# EAGLE design p128fet (EAGLE 9.6.2)
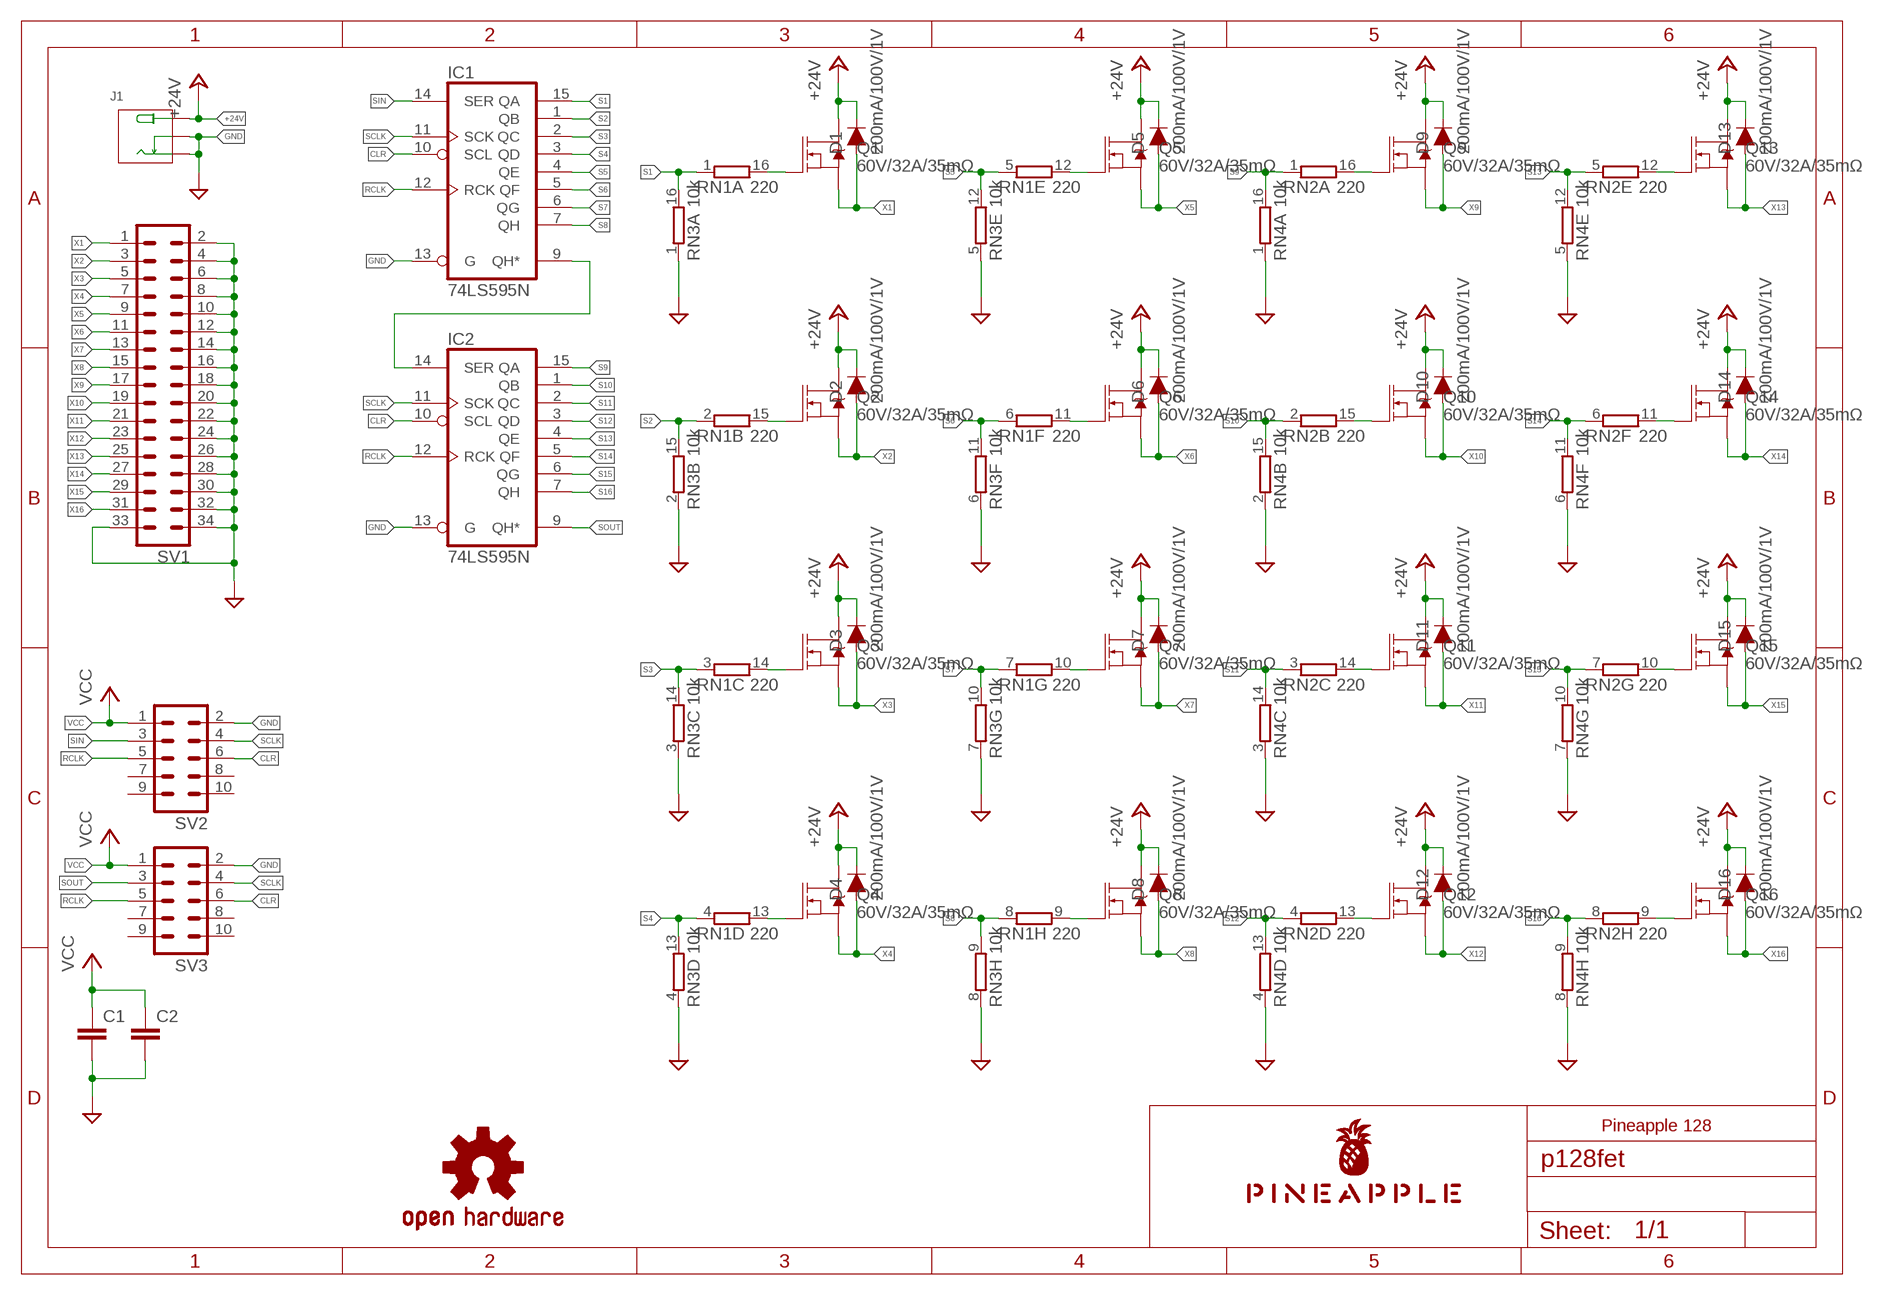
[diagram p0: schematic, sheet 1]

## Parts
C1  C-EU025-024X044  [C025-024X044]
C2  C-EU025-024X044  [C025-024X044]
D1  200mA/100V/1V  DIODE-1N4148  [DIODE-1N4148]
D2  200mA/100V/1V  DIODE-1N4148  [DIODE-1N4148]
D3  200mA/100V/1V  DIODE-1N4148  [DIODE-1N4148]
D4  200mA/100V/1V  DIODE-1N4148  [DIODE-1N4148]
D5  200mA/100V/1V  DIODE-1N4148  [DIODE-1N4148]
D6  200mA/100V/1V  DIODE-1N4148  [DIODE-1N4148]
D7  200mA/100V/1V  DIODE-1N4148  [DIODE-1N4148]
D8  200mA/100V/1V  DIODE-1N4148  [DIODE-1N4148]
D9  200mA/100V/1V  DIODE-1N4148  [DIODE-1N4148]
D10  200mA/100V/1V  DIODE-1N4148  [DIODE-1N4148]
D11  200mA/100V/1V  DIODE-1N4148  [DIODE-1N4148]
D12  200mA/100V/1V  DIODE-1N4148  [DIODE-1N4148]
D13  200mA/100V/1V  DIODE-1N4148  [DIODE-1N4148]
D14  200mA/100V/1V  DIODE-1N4148  [DIODE-1N4148]
D15  200mA/100V/1V  DIODE-1N4148  [DIODE-1N4148]
D16  200mA/100V/1V  DIODE-1N4148  [DIODE-1N4148]
IC1  74LS595N  [DIL16]
IC2  74LS595N  [DIL16]
J1  JACK-DC-005'DC-005'  [3P-L14.2*W11.0*H9.0MM]
LOGO1  OSHW-LOGOS-COPPER  [OSHW-LOGO-S_COPPER]
Q1  60V/32A/35mΩ  MOSFET-NCH-FQP30N06L  [TO220V]
Q2  60V/32A/35mΩ  MOSFET-NCH-FQP30N06L  [TO220V]
Q3  60V/32A/35mΩ  MOSFET-NCH-FQP30N06L  [TO220V]
Q4  60V/32A/35mΩ  MOSFET-NCH-FQP30N06L  [TO220V]
Q5  60V/32A/35mΩ  MOSFET-NCH-FQP30N06L  [TO220V]
Q6  60V/32A/35mΩ  MOSFET-NCH-FQP30N06L  [TO220V]
Q7  60V/32A/35mΩ  MOSFET-NCH-FQP30N06L  [TO220V]
Q8  60V/32A/35mΩ  MOSFET-NCH-FQP30N06L  [TO220V]
Q9  60V/32A/35mΩ  MOSFET-NCH-FQP30N06L  [TO220V]
Q10  60V/32A/35mΩ  MOSFET-NCH-FQP30N06L  [TO220V]
Q11  60V/32A/35mΩ  MOSFET-NCH-FQP30N06L  [TO220V]
Q12  60V/32A/35mΩ  MOSFET-NCH-FQP30N06L  [TO220V]
Q13  60V/32A/35mΩ  MOSFET-NCH-FQP30N06L  [TO220V]
Q14  60V/32A/35mΩ  MOSFET-NCH-FQP30N06L  [TO220V]
Q15  60V/32A/35mΩ  MOSFET-NCH-FQP30N06L  [TO220V]
Q16  60V/32A/35mΩ  MOSFET-NCH-FQP30N06L  [TO220V]
RN1  220  8R-N  [DIL16]
RN2  220  8R-N  [DIL16]
RN3  10k  8R-N  [DIL16]
RN4  10k  8R-N  [DIL16]
SV1  ML34L  [ML34L]
SV2  ML10L  [ML10L]
SV3  ML10L  [ML10L]
U$1  PINEAPPLE450_SILK  [PINEAPPLE450_SILK]

## Nets
+24V [power]: D1.C D2.C D3.C D4.C D5.C D6.C D7.C D8.C D9.C D10.C D11.C D12.C D13.C D14.C D15.C D16.C J1.+ Q1.2(D) Q2.2(D) Q3.2(D) Q4.2(D) Q5.2(D) Q6.2(D) Q7.2(D) Q8.2(D) Q9.2(D) Q10.2(D) Q11.2(D) Q12.2(D) Q13.2(D) Q14.2(D) Q15.2(D) Q16.2(D)
CLR: IC1.10(SCL) IC2.10(SCL) SV2.6 SV3.6
GND [gnd]: C1.2 C2.2 IC1.13(G) IC2.13(G) J1.-1(-) J1.-2(CDN) RN3.1 RN3.2 RN3.3 RN3.4 RN3.5 RN3.6 RN3.7 RN3.8 RN4.1 RN4.2 RN4.3 RN4.4 RN4.5 RN4.6 RN4.7 RN4.8 SV1.2 SV1.4 SV1.6 SV1.8 SV1.10 SV1.12 SV1.14 SV1.16 SV1.18 SV1.20 SV1.22 SV1.24 SV1.26 SV1.28 SV1.30 SV1.32 SV1.33 SV1.34 SV2.2 SV3.2
N$1: Q1.1(G) RN1.16
N$2: Q2.1(G) RN1.15
N$3: Q3.1(G) RN1.14
N$4: Q4.1(G) RN1.13
N$5: Q5.1(G) RN1.12
N$6: Q6.1(G) RN1.11
N$7: Q7.1(G) RN1.10
N$8: Q8.1(G) RN1.9
N$9: IC1.9(QH*) IC2.14(SER)
N$10: Q9.1(G) RN2.16
N$11: Q10.1(G) RN2.15
N$12: Q14.1(G) RN2.11
N$13: Q11.1(G) RN2.14
N$14: Q15.1(G) RN2.10
N$15: Q12.1(G) RN2.13
N$16: Q16.1(G) RN2.9
N$25: Q13.1(G) RN2.12
RCLK: IC1.12(RCK) IC2.12(RCK) SV2.5 SV3.5
S1: IC1.15(QA) RN1.1 RN3.16
S2: IC1.1(QB) RN1.2 RN3.15
S3: IC1.2(QC) RN1.3 RN3.14
S4: IC1.3(QD) RN1.4 RN3.13
S5: IC1.4(QE) RN1.5 RN3.12
S6: IC1.5(QF) RN1.6 RN3.11
S7: IC1.6(QG) RN1.7 RN3.10
S8: IC1.7(QH) RN1.8 RN3.9
S9: IC2.15(QA) RN2.1 RN4.16
S10: IC2.1(QB) RN2.2 RN4.15
S11: IC2.2(QC) RN2.3 RN4.14
S12: IC2.3(QD) RN2.4 RN4.13
S13: IC2.4(QE) RN2.5 RN4.12
S14: IC2.5(QF) RN2.6 RN4.11
S15: IC2.6(QG) RN2.7 RN4.10
S16: IC2.7(QH) RN2.8 RN4.9
SCLK: IC1.11(SCK) IC2.11(SCK) SV2.4 SV3.4
SIN: IC1.14(SER) SV2.3
SOUT: IC2.9(QH*) SV3.3
VCC: C1.1 C2.1 SV2.1 SV3.1
X1 [power]: D1.A Q1.3(S) SV1.1
X2 [power]: D2.A Q2.3(S) SV1.3
X3 [power]: D3.A Q3.3(S) SV1.5
X4 [power]: D4.A Q4.3(S) SV1.7
X5 [power]: D5.A Q5.3(S) SV1.9
X6 [power]: D6.A Q6.3(S) SV1.11
X7 [power]: D7.A Q7.3(S) SV1.13
X8 [power]: D8.A Q8.3(S) SV1.15
X9 [power]: D9.A Q9.3(S) SV1.17
X10 [power]: D10.A Q10.3(S) SV1.19
X11 [power]: D11.A Q11.3(S) SV1.21
X12 [power]: D12.A Q12.3(S) SV1.23
X13 [power]: D13.A Q13.3(S) SV1.25
X14 [power]: D14.A Q14.3(S) SV1.27
X15 [power]: D15.A Q15.3(S) SV1.29
X16 [power]: D16.A Q16.3(S) SV1.31
Unconnected: SV2.7 SV2.8 SV2.9 SV2.10 SV3.7 SV3.8 SV3.9 SV3.10

## Notes on the sheet
- Pineapple 128

## Power pins joined to a net without a drawn wire
GND: IC1.8(GND) IC2.8(GND)
VCC: IC1.16(VCC) IC2.16(VCC)

## Library data of the parts
C1 C2 = resistor:C-EU: CAPACITOR, European symbol
D1-D16 = SparkFun-DiscreteSemi:DIODE: Diode These are standard reverse protection diodes and small signal diodes. SparkFun Products: SparkFun SparkPunk Sound Kit <https://www.sparkfun.com/products/11177> SparkFun ESP8266 Thing <https://www.sparkfun.com/products/13231>; PROD_ID: DIO-08378
IC1 IC2 = 74xx-us:74*595: 8-bit SHIFT REGISTER, output latch
J1 = Seeed-Connector:JACK-DC-005: 320120003
LOGO1 = SparkFun-Aesthetics:OSHW-LOGO: Open-Source Hardware (OSHW) Logo This logo indicates the piece of hardware it is found on incorporates a OSHW license and/or adheres to the definition of open source hardware found here: http://freedomdefined.org/OSHW
Q1-Q16 = SparkFun-DiscreteSemi:MOSFET-NCH: N-channel MOSFETs Voltage controlled devices that allow control of high current outputs. SparkFun Products: SparkFun OpenScale <https://www.sparkfun.com/products/13261> SparkFun Digital Sandbox <https://www.sparkfun.com/products/12651> SparkFun Monster Moto Shield <https://www.sparkfun.com/products/10182> SparkFun MOSFET Power Controller <https://www.sparkfun.com/products/11214>; PROD_ID: TRANS-10060
RN1-RN4 = resistor-dil:8R-N: DIL RESISTOR; OC_FARNELL: unknown; OC_NEWARK: unknown
SV1 = con-ml:ML34L: HARTING; OC_FARNELL: unknown; OC_NEWARK: unknown
SV2 SV3 = con-ml:ML10L: HARTING; OC_FARNELL: unknown; OC_NEWARK: unknown
U$1 = pineapple:PINEAPPLE450_SILK

## Net classes
0 default: width 0.152 mm, drill 0.152 mm, clearance 0.152 mm
1 gnd: width 0.61 mm, drill 0.152 mm, clearance 0.152 mm
2 power: width 0.61 mm, drill 0.152 mm, clearance 0.152 mm
3 analog: width 0.305 mm, drill 0.152 mm, clearance 0.152 mm

## Board
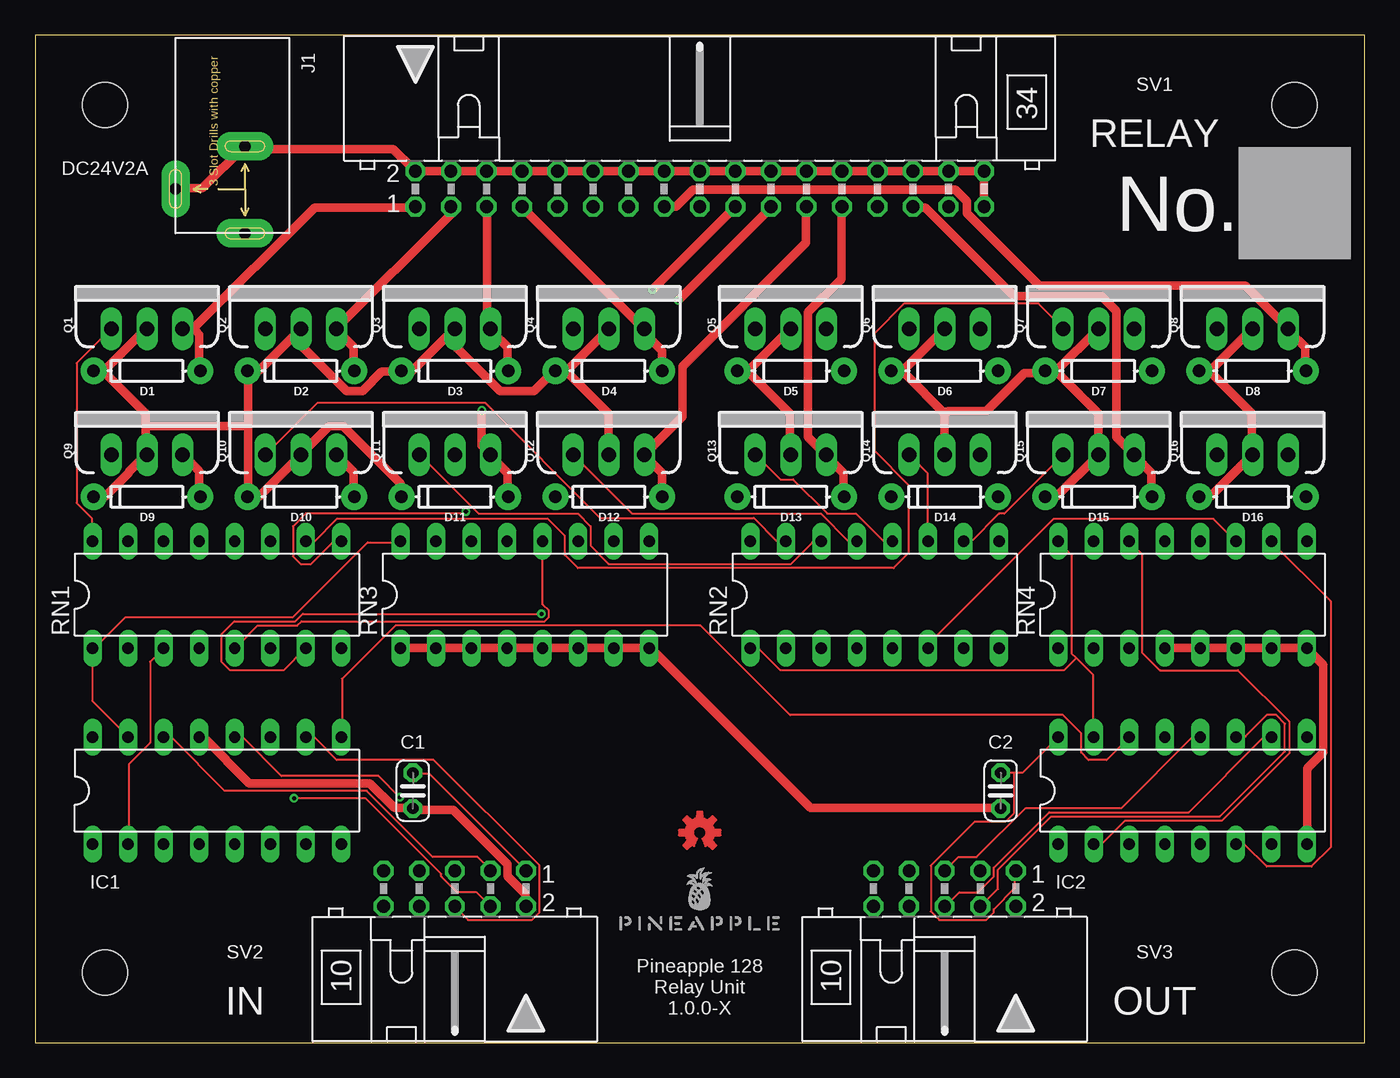
[diagram p1: board, top side]
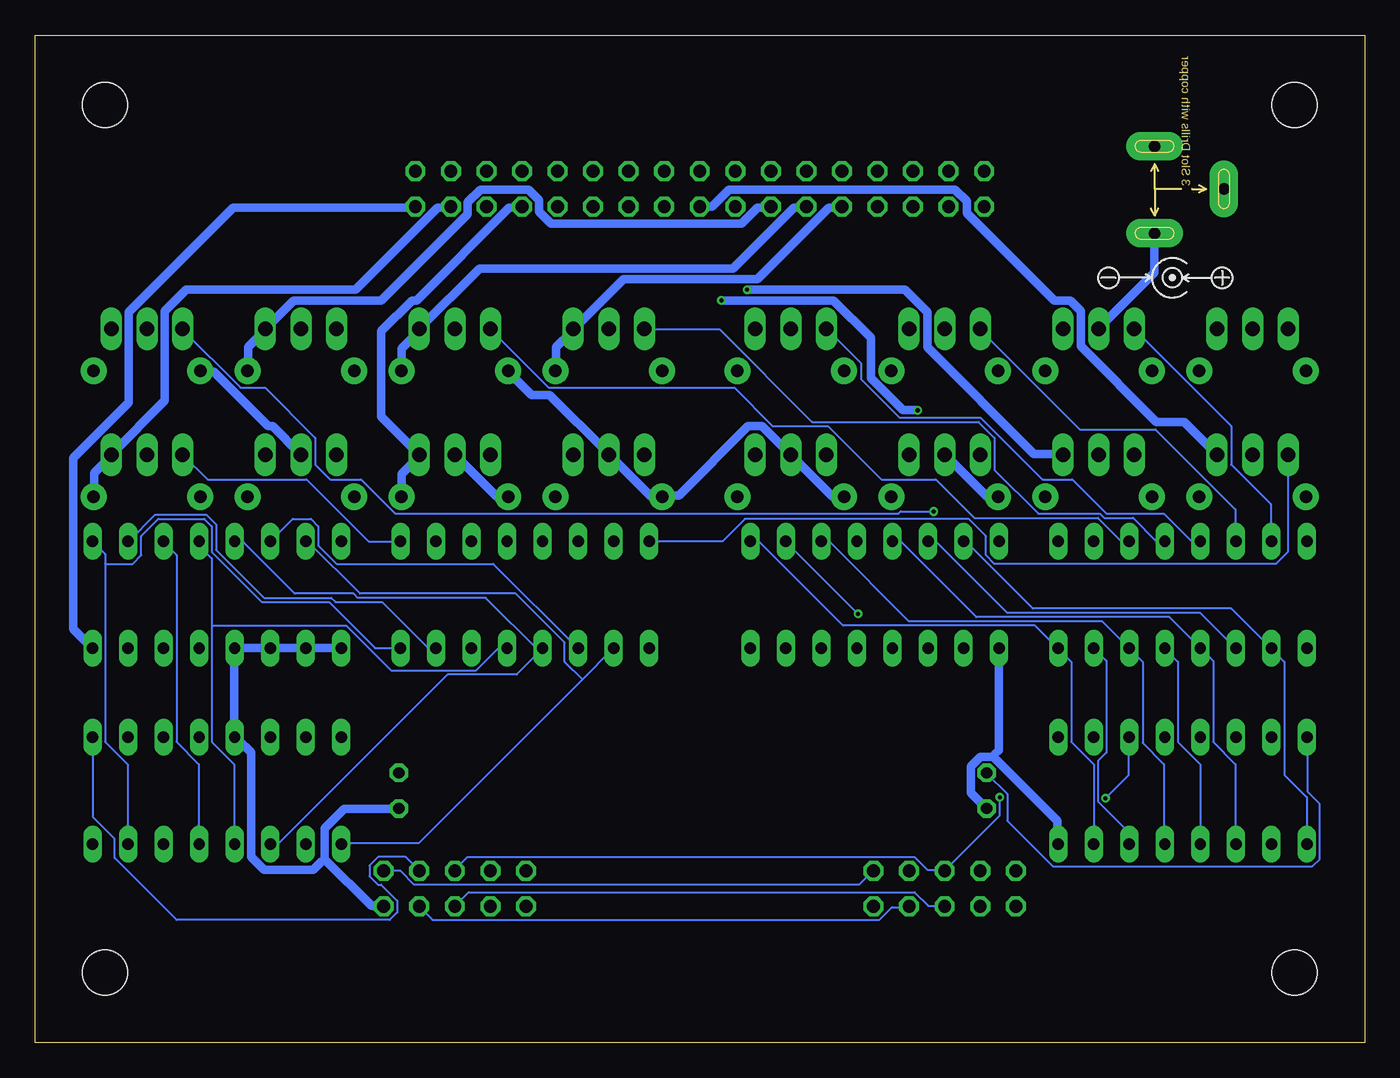
[diagram p2: board, bottom side, seen from below]

Size 95 x 72 mm. Coordinates in mm from the lower left corner, seen from the top.
Outline: 0,0 95,0 95,72 0,72 0,0
Copper layers (1*16): Top 0.035mm / dielectric 1.5mm / Bottom 0.035mm
Design rules "SeeedStudio_2layer_DRU_no_angle_20140221": minimum track width 6mil, minimum drill 12mil, track to track 6mil, track to pad 6mil, pad to pad 6mil, via to via 6mil, smd to smd 0mil, copper to edge 10mil, drill to drill 10mil, minimum pad ring 10mil, minimum via ring 6mil, stop-mask expansion 2mil, vias tented up to drill 100mil, thermal gap 10mil
Holes 3.2 mm at 5,5 90,5 90,67 5,67
tRestrict: area 2.8,64.8 to 7.2,69.2; area 87.8,64.8 to 92.2,69.2; area 2.8,2.8 to 7.2,7.2; area 87.8,2.8 to 92.2,7.2
bRestrict: area 2.8,2.8 to 7.2,7.2; area 87.8,2.8 to 92.2,7.2; area 87.8,64.8 to 92.2,69.2; area 2.8,64.8 to 7.2,69.2

### Footprints (pad centres in the part's own frame; a part is rotated, then mirrored left to right if it is on the bottom)
C025-024X044 = drill 0.813 octagon: 1 -1.27,0; 2 1.27,0
DIODE-1N4148 = drill 0.9 pad 1.88: A -3.81,0; C 3.81,0
DIL16 = drill 0.813 long: 1 -8.89,-3.81; 2 -6.35,-3.81; 3 -3.81,-3.81; 4 -1.27,-3.81; 5 1.27,-3.81; 6 3.81,-3.81; 7 6.35,-3.81; 8 8.89,-3.81; 9 8.89,3.81; 10 6.35,3.81; 11 3.81,3.81; 12 1.27,3.81; 13 -1.27,3.81; 14 -3.81,3.81; 15 -6.35,3.81; 16 -8.89,3.81
3P-L14.2*W11.0*H9.0MM = drill 0.813 pad 2.032 long: + 3.175,0; -1 -3.048,0; -2 0,-4.953
TO220V = drill 1.016 long: 1 -2.54,0; 2 0,0; 3 2.54,0
ML34L = drill 0.914 octagon: 1 -20.32,-1.27; 2 -20.32,1.27; 3 -17.78,-1.27; 4 -17.78,1.27; 5 -15.24,-1.27; 6 -15.24,1.27; 7 -12.7,-1.27; 8 -12.7,1.27; 9 -10.16,-1.27; 10 -10.16,1.27; 11 -7.62,-1.27; 12 -7.62,1.27; 13 -5.08,-1.27; 14 -5.08,1.27; 15 -2.54,-1.27; 16 -2.54,1.27; 17 0,-1.27; 18 0,1.27; 19 2.54,-1.27; 20 2.54,1.27; 21 5.08,-1.27; 22 5.08,1.27; 23 7.62,-1.27; 24 7.62,1.27; 25 10.16,-1.27; 26 10.16,1.27; 27 12.7,-1.27; 28 12.7,1.27; 29 15.24,-1.27; 30 15.24,1.27; 31 17.78,-1.27; 32 17.78,1.27; 33 20.32,-1.27; 34 20.32,1.27
ML10L = drill 0.914 octagon: 1 -5.08,-1.27; 2 -5.08,1.27; 3 -2.54,-1.27; 4 -2.54,1.27; 5 0,-1.27; 6 0,1.27; 7 2.54,-1.27; 8 2.54,1.27; 9 5.08,-1.27; 10 5.08,1.27

### Placement (x,y rotation side)
C1  27,18 270 top
C2  69,18 270 top
D1  8,48 180 top
D2  19,48 180 top
D3  30,48 180 top
D4  41,48 180 top
D5  54,48 180 top
D6  65,48 180 top
D7  76,48 180 top
D8  87,48 180 top
D9  8,39 180 top
D10  19,39 180 top
D11  30,39 180 top
D12  41,39 180 top
D13  54,39 180 top
D14  65,39 180 top
D15  76,39 180 top
D16  87,39 180 top
IC1  13,18 0 top
IC2  82,18 0 top
J1  15,61 270 top
LOGO1  47.5,15 0 top
Q1  8,51 0 top
Q2  19,51 0 top
Q3  30,51 0 top
Q4  41,51 0 top
Q5  54,51 0 top
Q6  65,51 0 top
Q7  76,51 0 top
Q8  87,51 0 top
Q9  8,42 0 top
Q10  19,42 0 top
Q11  30,42 0 top
Q12  41,42 0 top
Q13  54,42 0 top
Q14  65,42 0 top
Q15  76,42 0 top
Q16  87,42 0 top
RN1  13,32 0 top
RN2  60,32 0 top
RN3  35,32 0 top
RN4  82,32 0 top
SV1  47.5,61 0 top
SV2  30,11 180 top
SV3  65,11 180 top
U$1  47.5,8 0 top

### Tracks (layer width: path | path; a pad name or v marks a point on that pad's centre or on a via)
+24V
  Top 0.61: D16.C 83.21,39.01 83.97,39.01 86.94,41.99 Q16.2 86.94,42.29 86.94,44.96 84.12,47.78 D8.C 83.21,48.01 83.97,48.01 86.94,50.98 Q8.2 | D15.C 72.24,39.01 73,39.01 75.97,41.99 Q15.2 75.97,42.29 75.97,44.96 73.15,47.78 73,48.01 | 73,48.01 75.97,50.98 Q7.2 | 73,48.01 72.24,48.01 D7.C 71.93,47.85 70.71,47.85 67.97,45.11 65.23,45.11 65,44.96 | 50.98,48.01 53.95,50.98 Q5.2 | 50.98,48.01 50.22,48.01 D5.C | Q13.2 53.95,42.06 53.95,44.96 51.13,47.78 50.98,48.01 | 62.03,48.01 65,50.98 Q6.2 | 62.03,48.01 61.27,48.01 D6.C | 65,44.96 65,42.06 Q14.2 | 65,44.96 62.18,47.78 62.03,48.01 | 38.02,48.01 41,50.98 Q4.2 | 38.02,48.01 37.26,48.01 D4.C 36.96,47.85 35.66,46.56 33.22,46.56 29.57,50.22 Q3.2 29.95,50.98 26.98,48.01 26.21,48.01 D3.C 25.91,47.93 24.77,47.93 23.39,46.56 22.25,46.56 18.59,50.22 Q2.2 18.97,50.98 16,48.01 15.24,48.01 D2.C 15.24,47.7 15.24,44.04 | Q12.2 41,42.06 41,44.96 38.18,47.78 38.02,48.01 | D9.C 4.19,39.01 5.03,39.01 6.71,40.69 6.71,40.77 7.92,41.99 Q9.2 7.92,42.29 7.92,44.04 | Q1.2 7.92,50.98 4.95,48.01 D1.C 5.11,47.78 7.92,44.96 7.92,44.04 | 15.24,44.04 15.24,39.32 D10.C 15.24,39.01 16,39.01 18.97,41.99 Q10.2 19.2,42.22 21.03,44.04 22.02,44.04 26.14,39.93 26.14,39.01 D11.C | 15.24,44.04 7.92,44.04
  Bottom 0.61: Q14.2 65,41.99 62.03,39.01 61.27,39.01 D14.C | D6.C 61.19,47.93 59.51,46.25 58.22,46.25 54.18,42.22 Q13.2 53.95,41.99 50.98,39.01 50.22,39.01 D13.C 49.91,39.09 49,39.09 44.04,44.04 43.05,44.04 41.22,42.22 Q12.2 41,41.99 38.02,39.01 37.26,39.01 D12.C | D8.C 83.13,47.93 82.22,47.93 78.33,44.04 78.03,44.04 76.05,42.06 Q15.2 | Q11.2 29.95,41.99 26.98,39.01 26.21,39.01 D11.C | J1.+ 15.01,57.76 15.01,55.02 18.97,51.05 Q2.2
CLR
  Top 0.152: IC1.10 19.36,21.79 19.96,21.79 21.57,20.19 28.5,20.19 36.04,12.65 36.04,9.3 35.51,8.76 30.94,8.76 30.02,9.68 SV2.6 | IC2.10 88.32,21.79 87.78,21.79 82.45,16.46 72.47,16.46 68.5,12.5 68.5,11.89 67.36,10.74 66.06,10.74 65.08,9.75 SV3.6
  Bottom 0.152: SV2.6 30.02,9.75 31.17,9.75 32.16,10.74 64.01,10.74 65,9.75 SV3.6
GND
  Top 0.61: J1.-2 10.06,61.04 11.96,61.04 14.94,64.01 J1.-1 15.24,63.86 25.6,63.86 26.98,62.48 SV1.2 27.2,62.26 29.72,62.26 SV1.4 30.02,62.26 32.23,62.26 SV1.6 32.54,62.26 34.75,62.26 SV1.8 35.05,62.26 37.34,62.26 SV1.10 37.64,62.26 39.85,62.26 SV1.12 40.16,62.26 42.37,62.26 SV1.14 42.67,62.26 44.96,62.26 SV1.16 45.26,62.26 47.47,62.26 SV1.18 47.78,62.26 49.99,62.26 SV1.20 50.29,62.26 52.58,62.26 SV1.22 52.88,62.26 55.09,62.26 SV1.24 55.4,62.26 57.61,62.26 SV1.26 57.91,62.26 60.2,62.26 SV1.28 60.5,62.26 62.71,62.26 SV1.30 63.02,62.26 65.23,62.26 SV1.32 65.53,62.26 67.51,62.26 SV1.34 67.82,62.26 SV1.33 | IC2.8 90.91,14.25 90.91,19.58 92.05,20.73 92.05,26.98 90.91,28.12 RN4.8 90.6,28.19 88.39,28.19 RN4.7 88.09,28.19 86.11,28.19 RN4.6 83.52,28.19 RN4.5 83.21,28.19 80.77,28.19 RN4.4 | RN3.1 26.14,28.19 28.57,28.19 RN3.2 28.88,28.19 31.17,28.19 RN3.3 31.47,28.19 33.68,28.19 RN3.4 33.98,28.19 36.2,28.19 RN3.5 36.5,28.19 38.79,28.19 RN3.6 39.09,28.19 41.3,28.19 RN3.7 41.6,28.19 43.81,28.19 RN3.8 44.12,28.04 55.4,16.76 68.96,16.76 C2.2 | IC1.13 11.73,21.79 12.04,21.79 15.32,18.52 23.93,18.52 25.68,16.76 26.98,16.76 C1.2 27.28,16.61 29.87,16.61 33.76,12.72 33.76,11.89 35.05,10.59 35.05,9.75 SV2.2
  Bottom 0.61: 74.3,13.11 74.3,15.32 72.92,16.69 69.04,16.69 C2.2 | 74.3,13.11 70.94,9.75 70.1,9.75 SV3.2 | RN4.1 73.15,28.19 75.59,28.19 RN4.2 75.89,28.19 77.95,28.19 RN4.3 78.26,28.19 80.47,28.19 RN4.4 80.77,28.12 80.77,21.87 IC2.13 80.47,21.64 79.55,20.73 79.55,13.26 78.64,12.34 75.13,12.34 74.52,12.95 74.3,13.11 | 26.52,20.42 21.95,15.85 21.95,14.25 IC1.8 | 26.52,20.42 27.43,20.42 28.12,19.74 28.12,17.83 27.05,16.76 C1.2 | RN3.1 26.14,28.12 26.14,20.88 26.36,20.65 26.52,20.42 | SV1.33 67.89,59.66 80.85,59.66 88.32,52.2 88.32,45.72 92.28,41.76 92.28,29.57 90.91,28.19 RN4.8
N$1
  Top 0.152: RN1.16 4.04,35.81 4.04,37.49 2.97,38.56 2.97,48.54 5.41,50.98 Q1.1
N$2
  Bottom 0.152: RN1.15 6.71,35.81 6.71,38.48 9.53,41.3 9.53,44.04 16.46,50.98 Q2.1
N$3
  Bottom 0.152: RN1.14 9.22,35.81 9.22,38.1 14.94,43.81 20.34,43.81 27.51,50.98 Q3.1
N$4
  Bottom 0.152: RN1.13 12.34,35.81 14.33,37.8 18.44,37.8 20.88,40.23 23.01,40.23 27.43,44.65 33.22,44.65 35.97,47.4 35.97,48.54 38.41,50.98 Q4.1
N$5
  Bottom 0.152: RN1.12 14.33,35.81 14.86,35.81 16.54,37.49 18.59,37.49 18.9,37.8 23.32,37.8 26.44,40.92 26.44,43.2 27.58,44.35 39.47,44.35 46.1,50.98 51.44,50.98 Q5.1
N$6
  Bottom 0.152: RN1.11 16.84,35.81 17.37,35.81 19.05,37.49 27.89,37.49 30.63,40.23 34.52,40.23 38.33,44.04 42.29,44.04 45.03,46.79 58.29,46.79 62.48,50.98 Q6.1
N$7
  Top 0.152: RN1.10 19.96,35.81 21.57,37.41 36.65,37.41 37.87,36.2 37.87,34.82 38.79,33.91 61.34,33.91 62.41,34.98 62.41,39.85 59.97,42.29 59.97,50.67 62.1,52.81 71.7,52.81 73.46,51.05 Q7.1
N$8  (via drill 0.3)
  Top 0.152: v30.79,37.95 30.63,37.8 19.36,37.8 18.44,36.88 18.44,34.75 18.97,34.21 19.74,34.21 21.26,35.74 21.87,35.74 RN1.9
  Bottom 0.152: v30.79,37.95 33.15,37.95 33.3,37.8 69.27,37.8 71.7,40.23 73.91,40.23 74.98,41.3 74.98,43.2 78.56,46.79 80.31,46.79 84.51,50.98 Q8.1
N$9
  Top 0.152: IC1.9 21.95,21.87 21.95,25.98 25.76,29.79 47.55,29.79 53.95,23.39 73.46,23.39 74.75,22.1 74.75,20.73 75.29,20.19 76.58,20.19 78.18,21.79 IC2.14
N$10
  Bottom 0.152: RN2.16 51.05,35.81 45.87,35.81 44.27,37.41 28.27,37.41 27.05,36.2 27.05,34.82 26.44,34.21 6.33,34.21 5.49,35.05 5.49,41.99 Q9.1
N$11
  Top 0.152: RN2.15 53.03,35.81 51.36,37.49 40.39,37.49 32.16,45.72 20.19,45.72 16.54,42.06 Q10.1
N$12
  Top 0.152: RN2.11 63.78,35.81 63.78,40.69 62.48,41.99 Q14.1
N$13
  Top 0.152: RN2.14 56.16,35.74 55.55,35.74 54.03,34.21 41,34.21 39.7,35.51 39.7,36.88 38.79,37.8 31.7,37.8 27.51,41.99 Q11.1
N$14
  Top 0.152: RN2.10 66.37,35.81 66.9,35.81 68.89,37.8 69.27,37.8 73.46,41.99 Q15.1
N$15
  Top 0.152: RN2.13 58.67,35.81 58.14,35.81 56.16,37.8 42.67,37.8 38.48,41.99 Q12.1
N$16
  Bottom 0.152: RN2.9 68.96,35.81 71.17,35.81 75.59,40.23 82.68,40.23 84.43,41.99 Q16.1
N$25
  Top 0.152: RN2.12 60.66,35.81 58.67,37.8 56.62,37.8 54.18,40.23 53.26,40.23 51.51,41.99 Q13.1
RCLK  (via drill 0.3)
  Top 0.152: v26.06,17.53 24.54,19.05 17.6,19.05 14.86,21.79 14.33,21.79 IC1.12 | IC2.12 83.21,21.79 82.68,21.79 77.65,16.76 70.79,16.76 67.28,13.26 65.99,13.26 65.08,12.34 SV3.5
  Bottom 0.152: v26.06,17.53 26.06,16.23 29.95,12.34 SV2.5 30.02,12.34 31.24,12.34 32.16,13.26 64.08,13.26 65,12.34 SV3.5
S1
  Top 0.152: IC1.15 6.63,21.87 4.12,24.38 4.12,28.12 RN1.1 4.19,28.12 6.48,30.4 18.44,30.4 23.77,35.74 26.06,35.74 RN3.16
S2
  Bottom 0.152: IC1.1 4.12,14.25 4.12,17.53 5.71,19.13 5.71,27.2 6.63,28.12 RN1.2 6.71,28.19 9.53,31.01 23.7,31.01 28.42,35.74 28.57,35.74 RN3.15
S3
  Top 0.152: IC1.2 6.71,14.25 6.71,19.89 8.23,21.41 8.23,27.2 9.14,28.12 RN1.3
  Bottom 0.152: RN3.14 31.17,35.74 30.56,35.74 25.53,30.71 11.73,30.71 9.22,28.19 RN1.3
S4
  Bottom 0.152: IC1.3 9.22,14.25 9.22,19.89 10.82,21.49 10.82,27.28 11.66,28.12 RN1.4 13.95,30.4 27.74,30.4 33.07,35.74 33.68,35.74 RN3.13
S5
  Top 0.152: RN3.12 36.27,35.74 36.27,31.32 36.73,30.86 36.73,30.4 36.42,30.1 19.05,30.1 18.75,29.79 15.93,29.79 14.33,28.19 RN1.5
  Bottom 0.152: IC1.4 11.73,14.25 11.73,19.89 13.34,21.49 13.34,27.2 14.25,28.12 RN1.5
S6
  Bottom 0.152: IC1.5 14.33,14.25 14.33,19.89 15.85,21.41 15.85,27.2 16.76,28.12 RN1.6 16.84,28.19 18.75,30.1 32.54,30.1 38.18,35.74 38.79,35.74 RN3.11
S7  (via drill 0.3)
  Top 0.152: v36.2,30.63 19.13,30.63 18.59,30.1 14.25,30.1 13.34,29.18 13.34,27.2 13.95,26.59 17.75,26.59 19.28,28.12 RN1.7
  Bottom 0.152: IC1.6 16.84,14.25 16.84,15.01 19.05,17.22 19.05,20.12 18.44,20.73 18.44,27.28 19.28,28.12 RN1.7 | v36.2,30.63 41.3,35.74 RN3.10
S8
  Bottom 0.152: IC1.7 19.36,14.25 19.36,19.89 20.95,21.49 20.95,27.2 21.87,28.12 RN1.8 21.95,28.19 23.55,29.79 37.26,29.79 43.2,35.74 43.81,35.74 RN3.9
S9
  Top 0.152: 74.41,27.47 74.07,27.81 74.07,34.82 73.15,35.74 RN4.16 | 74.41,27.47 75.59,26.29 75.59,21.87 IC2.15 | 74.41,27.47 73.53,26.59 53.26,26.59 51.74,28.12 51.13,28.12 RN2.1
S10
  Bottom 0.152: 55.89,25.95 53.72,28.12 RN2.2 | 55.89,25.95 67.59,14.25 73.08,14.25 IC2.1 | 55.89,25.95 57.15,27.2 57.15,28.57 60.66,32.08 71.78,32.08 75.44,35.74 75.59,35.74 RN4.15
S11
  Top 0.152: IC2.2 75.67,14.25 76.28,14.25 77.88,15.85 84.81,15.85 89.61,20.65 89.61,22.94 85.95,26.59 80.39,26.59 79.1,27.89 79.1,34.9 78.26,35.74 RN4.14
  Bottom 0.152: RN2.3 56.24,28.19 62.26,34.21 73.46,34.21 74.75,35.51 74.75,36.88 75.29,37.41 76.58,37.41 RN4.14
S12
  Bottom 0.152: IC2.3 78.18,14.25 77.57,14.25 65.53,26.29 60.58,26.29 58.75,28.12 RN2.4 58.98,27.96 62.79,31.77 71.93,31.77 72.24,32.08 76.43,32.08 80.09,35.74 80.7,35.74 RN4.13
S13
  Bottom 0.152: 82.37,29.79 82.37,34.59 83.21,35.43 83.21,35.74 RN4.12 | 82.37,29.79 82.37,21.49 80.77,19.89 80.77,14.25 IC2.4 | 82.37,29.79 72.77,29.79 69.57,26.59 63.48,26.59 61.95,28.12 61.34,28.12 RN2.5
S14
  Top 0.152: RN2.6 63.86,28.19 63.86,28.5 72.77,37.41 84.2,37.41 RN4.11
  Bottom 0.152: IC2.5 83.29,14.25 83.29,19.89 84.89,21.49 84.89,34.82 85.8,35.74 RN4.11
S15
  Top 0.152: IC2.6 85.88,14.17 86.41,14.17 88.01,12.57 91.21,12.57 92.58,13.95 92.58,31.55 88.39,35.74 RN4.10
  Bottom 0.152: RN2.7 66.37,28.19 66.9,28.19 70.18,31.47 73.53,31.47 73.84,31.77 78.64,31.77 82.07,35.2 82.07,37.03 82.75,37.72 86.41,37.72 88.32,35.81 RN4.10
S16
  Bottom 0.152: 89.99,34.21 89.99,34.9 90.83,35.74 RN4.9 | 89.99,34.21 89.99,21.49 88.39,19.89 88.39,14.25 IC2.7 | 89.99,34.21 88.01,34.21 87.4,34.82 87.4,36.2 86.18,37.41 82.91,37.41 82.37,36.88 82.37,35.05 78.79,31.47 73.99,31.47 70.71,28.19 68.96,28.19 RN2.8
SCLK  (via drill 0.3)
  Top 0.152: v18.52,17.45 23.62,17.45 29.03,12.04 29.03,11.89 30.18,10.74 31.55,10.74 32.54,9.75 SV2.4 | IC2.11 85.88,21.87 86.49,21.87 88.01,23.39 88.7,23.39 89.31,22.78 89.31,20.8 84.66,16.15 72.62,16.15 68.81,12.34 68.81,10.97 67.59,9.75 SV3.4
  Bottom 0.152: v18.52,17.45 16.84,19.13 16.84,21.79 IC1.11 | SV2.4 32.61,9.68 33.76,9.68 34.67,8.76 66.6,8.76 67.51,9.68 SV3.4
SIN
  Top 0.152: IC1.14 9.22,21.79 9.75,21.79 13.56,17.98 23.7,17.98 28.42,13.26 31.62,13.26 32.54,12.34 SV2.3
SOUT
  Bottom 0.152: IC2.9 90.83,21.79 90.83,16.08 89.31,14.55 89.31,13.18 84.89,8.76 69.65,8.76 69.11,9.3 69.11,10.13 70.26,11.28 70.48,11.28 71.09,11.89 71.09,12.65 70.48,13.26 68.5,13.26 67.59,12.34 SV3.3
VCC
  Top 0.152: 69.95,19.28 70.56,19.28 73.08,21.79 IC2.16 | 69.95,19.28 69.04,19.28 C2.1 | 69.95,19.28 69.95,16.38 69.34,15.77 67.13,15.77 64.01,12.65 64.01,9.37 64.62,8.76 67.97,8.76 68.5,9.3 68.5,9.53 70.03,11.05 70.03,12.27 SV3.1 | C1.1 27.05,19.2 28.19,19.2 35.05,12.34 SV2.1
  Bottom 0.152: IC1.16 4.04,21.79 4.04,17.91 3.2,17.07 3.2,13.11 3.73,12.57 22.25,12.57 25.53,15.85 25.53,17.75 26.98,19.2 C1.1 | SV3.1 70.03,12.27 68.89,12.27 67.89,11.28 36.12,11.28 35.13,12.27 SV2.1
X1
  Top 0.61: 11.35,51.05 19.96,59.66 27.13,59.66 SV1.1 | 11.35,51.05 10.59,51.05 Q1.3 | D1.A 11.73,48.01 11.73,50.6 11.51,50.83 11.35,51.05
X2
  Top 0.61: SV1.3 29.72,59.66 29.72,59.21 21.57,51.05 Q2.3 21.72,50.75 22.78,49.68 22.78,48.01 D2.A
X3
  Top 0.61: SV1.5 32.31,59.66 32.31,51.28 32.54,51.05 Q3.3 32.69,50.75 33.76,49.68 33.76,48.01 D3.A
X4
  Top 0.61: SV1.7 34.82,59.66 43.51,50.98 Q4.3 43.59,50.67 44.81,49.45 D4.A
X5
  Bottom 0.61: SV1.9 37.41,59.66 38.25,59.66 43.36,54.56 52.96,54.56 56.46,51.05 Q5.3 56.69,50.75 57.76,49.68 57.76,48.01 D5.A
X6
  Bottom 0.61: SV1.11 39.93,59.66 40.77,59.66 45.11,55.32 63.25,55.32 67.51,51.05 Q6.3 67.67,50.75 68.81,49.61 D6.A
X7
  Bottom 0.61: SV1.13 42.44,59.66 43.36,59.66 44.5,58.52 58.14,58.52 58.98,59.36 58.98,60.2 59.74,60.96 63.17,60.96 64.08,60.05 64.08,59.21 70.26,53.03 76.5,53.03 Q7.3 78.72,50.75 79.78,49.68 79.78,48.01 D7.A
X8
  Top 0.61: SV1.15 45.03,59.74 45.8,59.74 47.02,60.96 65.76,60.96 66.6,60.12 66.6,59.28 71.78,54.1 86.49,54.1 89.53,51.05 Q8.3 89.69,50.75 90.75,49.68 90.75,48.01 D8.A
X9
  Top 0.61: D9.A 11.73,39.01 11.73,40.84 10.59,41.99 Q9.3
  Bottom 0.61: SV1.17 47.47,59.74 46.63,59.74 45.41,60.96 29.26,60.96 28.42,60.12 28.42,59.28 22.17,53.03 21.03,53.03 20.27,52.27 20.27,49.76 14.86,44.35 12.88,44.35 10.59,42.06 Q9.3
X10  (via drill 0.3)
  Top 0.61: v44.12,53.8 49.99,59.66 SV1.19 | D10.A 22.78,39.01 22.78,40.77 21.57,41.99 Q10.3
  Bottom 0.61: v44.12,53.8 32.84,53.8 31.24,52.2 31.24,49.68 23.62,42.06 21.57,42.06 Q10.3
X11  (via drill 0.3)
  Top 0.61: v45.95,53.03 52.58,59.66 SV1.21 | v31.93,45.19 31.93,42.67 32.54,42.06 Q11.3 32.69,41.76 33.76,40.69 33.76,39.01 D11.A
  Bottom 0.61: v45.95,53.03 37.95,53.03 35.28,50.37 35.28,47.47 32.99,45.19 v31.93,45.19
X12
  Top 0.61: SV1.23 55.09,59.66 55.09,57.15 46.25,48.31 46.25,44.73 43.59,42.06 Q12.3 43.74,41.76 44.81,40.69 44.81,39.01 D12.A
X13
  Top 0.61: SV1.25 57.61,59.66 57.61,54.56 55.24,52.2 55.24,43.28 56.46,42.06 Q13.3 56.69,41.76 57.76,40.69 57.76,39.01 D13.A
X14
  Bottom 0.61: SV1.27 60.27,59.66 61.11,59.66 67.74,53.03 68.05,53.03 70.26,50.83 70.26,44.73 67.59,42.06 Q14.3 67.67,41.76 68.81,40.62 68.81,39.01 D14.A
X15
  Top 0.61: SV1.29 62.79,59.66 63.63,59.66 69.95,53.34 76.2,53.34 77.27,52.27 77.27,43.28 78.49,42.06 Q15.3 78.72,41.76 79.78,40.69 79.78,39.01 D15.A
X16
  Bottom 0.61: SV1.31 65.3,59.66 66.22,59.66 72.08,53.8 84.2,53.8 85.72,52.27 85.72,45.87 89.53,42.06 Q16.3 89.69,41.76 90.75,40.69 90.75,39.01 D16.A

### Text on the board
tNames: RELAY | DC24V2A | No. | IN | Pineapple 128 / Relay Unit / 1.0.0-X | OUT